# Altium schematic sheet circuit.SchDoc
size A4
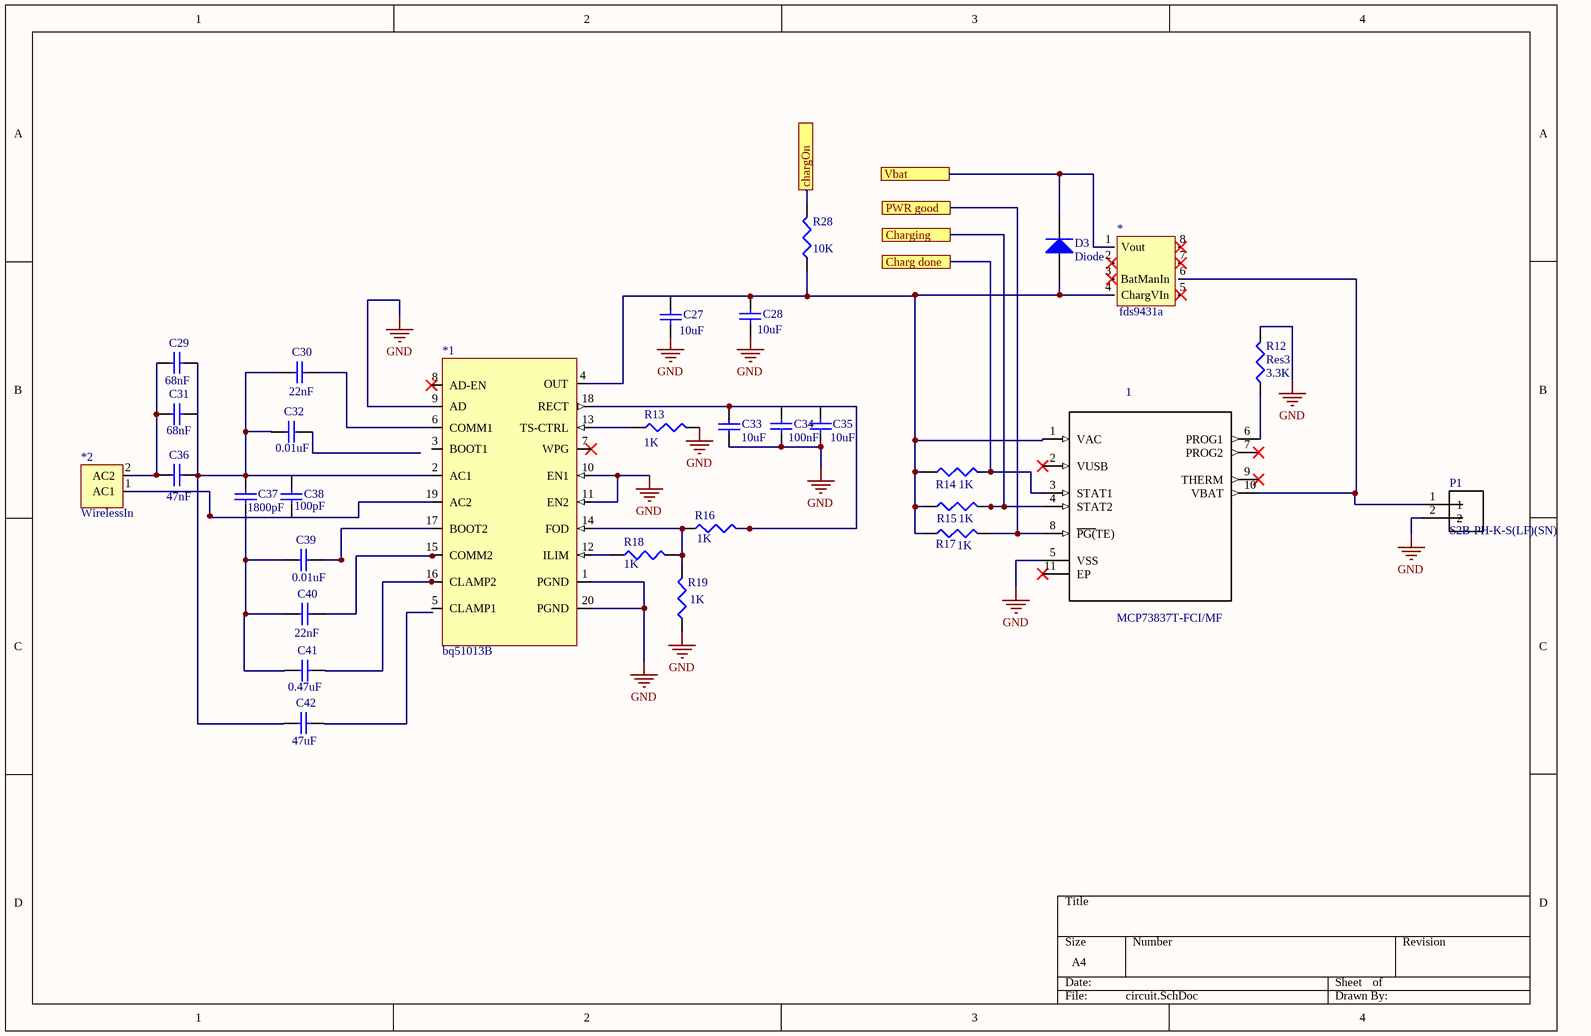
[diagram p0: circuit.SchDoc]

## Parts
1  MCP73837T-FCI/MF  [DFN300X300X100-11N]
*  fds9431a  [SOIC127P600X175-8N]
*1  bq51013B  [CONTROLLER_MSP430FR2522IRHLT]
*2  WirelessIn  [WirelessIn]
C27  value 10uF  [1608[0603]]  (hidden comment: Cap Semi)
C28  value 10uF  [1608[0603]]  (hidden comment: Cap Semi)
C29  value 68nF  [1608[0603]]  (hidden comment: Cap Semi)
C30  value 22nF  [1608[0603]]  (hidden comment: Cap Semi)
C31  value 68nF  [1608[0603]]  (hidden comment: Cap Semi)
C32  value 0.01uF  [1608[0603]]  (hidden comment: Cap Semi)
C33  value 10uF  [1608[0603]]  (hidden comment: Cap Semi)
C34  value 100nF  [1608[0603]]  (hidden comment: Cap Semi)
C35  value 10uF  [1608[0603]]  (hidden comment: Cap Semi)
C36  value 47nF  [1608[0603]]  (hidden comment: Cap Semi)
C37  value 1800pF  [1608[0603]]  (hidden comment: Cap Semi)
C38  value 100pF  [1608[0603]]  (hidden comment: Cap Semi)
C39  value 0.01uF  [1608[0603]]  (hidden comment: Cap Semi)
C40  value 22nF  [1608[0603]]  (hidden comment: Cap Semi)
C41  value 0.47uF  [1608[0603]]  (hidden comment: Cap Semi)
C42  value 47uF  [1608[0603]]  (hidden comment: Cap Semi)
D3  Diode  [SMC]
P1  S2B-PH-K-S(LF)(SN)  [JST_S2B-PH-K-S(LF)(SN)]
R12  Res3  value 3.3K  [J1-0603]
R13  value 1K  [J1-0603]  (hidden comment: Res3)
R14  value 1K  [J1-0603]  (hidden comment: Res3)
R15  value 1K  [J1-0603]  (hidden comment: Res3)
R16  value 1K  [J1-0603]  (hidden comment: Res3)
R17  value 1K  [J1-0603]  (hidden comment: Res3)
R18  value 1K  [J1-0603]  (hidden comment: Res3)
R19  value 1K  [J1-0603]  (hidden comment: Res3)
R28  value 10K  [J1-0603]  (hidden comment: Res3)

## Ports
Charg done, Charging, chargOn, PWR good, Vbat

## Nets
GND: 1.5(VSS) *1.1(PGND) *1.9(AD) *1.10(EN1) *1.11(EN2) *1.20(PGND) C33.1 C34.1 C35.1 P1.2 R12.2 R13.2 R19.1
Charg done: 1.3(STAT1) R14.2 ; port Charg done
Charging: 1.4(STAT2) R15.2 ; port Charging
chargOn: R28.2 ; port chargOn
PWR good: 1.8(~{PG(}TE)) R17.2 ; port PWR good
Vbat: *.1(Vout) D3.2(K) ; port Vbat
Net1_1: 1.1(VAC) *.4(ChargVIn) *1.4(OUT) C28.2 D3.1(A) R14.1 R15.1 R17.1 R28.1
Net1_6: 1.6(PROG1) R12.1
Net1_10: 1.10(VBAT) P1.1
Net*1_2: *1.2(AC1) C29.2 C30.1 C32.1 C42.1
Net*1_6: *1.6(COMM1) C30.2
Net*1_12: *1.12(ILIM) R18.1
Net*1_13: *1.13(TS-CTRL) R13.1
Net*1_14: *1.14(FOD) R16.1 R18.2 R19.2
Net*1_15: *1.15(COMM2) C40.2
Net*1_16: *1.16(CLAMP2) C41.2
Net*1_17: *1.17(BOOT2) C39.2
Net*1_18: *1.18(RECT) C33.2 C34.2 C35.2 R16.2
Net*1_19: *1.19(AC2) *2.1(AC1)
Net*2_2: *2.2(AC2) C29.1 C31.1 C36.1
NetC37_1: C37.1 C39.1 C40.1 C41.1

Not connected (* = marked no-connect by the designer): 1 2(VUSB)* 7(PROG2)* 9(THERM)* 11(EP)*; * 2(22)* 3(23)* 5(22)* 6(BatManIn) 7(22)* 8(22)*; *1 3(BOOT1) 5(CLAMP1) 7(WPG)* 8(AD-EN)*; C27 1 2; C28 1; C31 2; C32 2; C36 2; C37 2; C38 1 2; C42 2

## Notes on the sheet
- Labels drawn without touching a wire or pin: GND
- (in symbol MCP73837T-FCI/MF) Text

## Library data of the parts
1 = MCP73837T-FCI/MF: MCP73837 Series 6 V Linear Battery Charge Controller Surface Mount - DFN-10; MF: Microchip; Package: DFN-10 Microchip; SnapEDA_Link: https://www.snapeda.com/symbols-footprints/MCP73837T-FCI/MF/Microchip/view-part/?ref=snap; MP: MCP73837T-FCI/MF; Availability: Good; Price: 0.98 USD; Value: *
C27-C42 = Cap Semi: Capacitor (Semiconductor SIM Model); Published: 8-Jun-2000; LatestRevisionDate: 29-May-2009; LatestRevisionNote: IPC-7351 Footprint Added.; PackageReference: C1206; Publisher: Altium Limited; PackageDescription: Chip Capacitor
D3 = Diode: Default Diode; Published: 8-Jun-2000; LatestRevisionDate: 17-Jul-2002; LatestRevisionNote: Re-released for DXP Platform.; PackageVersion: Sep-1996; PackageReference: SMC; Publisher: Altium Limited; PackageDescription: DO-214-AB/SMC; 2 C-Bend Leads; Body 7.9 x 5.9 mm, inc. leads (LxW); Code_JEDEC: DO-214-AB
P1 = S2B-PH-K-S(LF)(SN): Header Side Entry 2way; MF: JST; SnapEDA_Link: https://www.snapeda.com/symbols-footprints/S2B-PH-K-S%20%28LF%29%28SN%29/JST/view-part/?ref=snap; Availability: Good; Package: None; Price: 0.12 USD; MP: S2B-PH-K-S (LF)(SN); Value: *
R12-R19 R28 = Res3: Resistor; Published: 8-Jun-2000; LatestRevisionDate: 29-May-2009; LatestRevisionNote: IPC-7351 Footprint Added.; PackageReference: J1-0603; Publisher: Altium Limited; PackageDescription: Chip Resistor